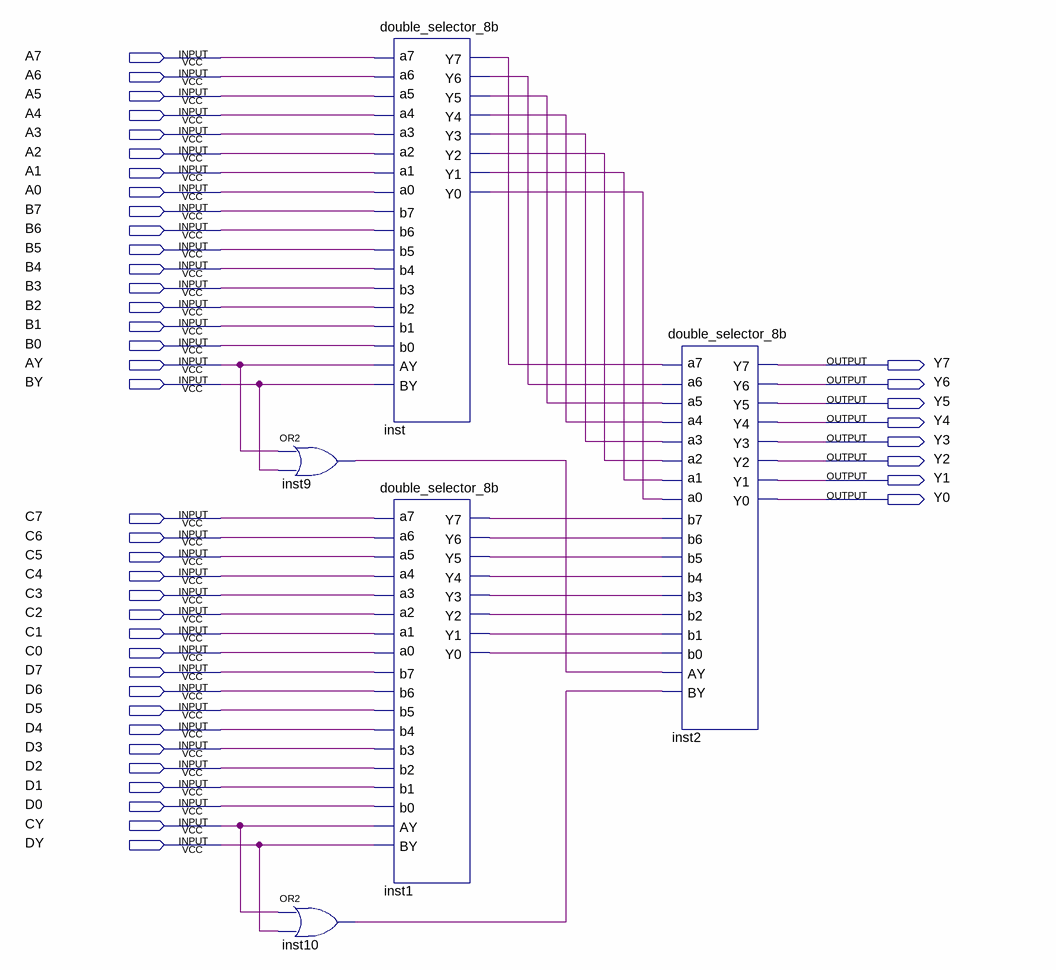
[diagram p0: schematic sheet]
// Quartus schematic quarter_selector_8b.bdf as structural Verilog: 5 symbols, 44 pins
module quarter_selector_8b (
  input  A7,
  input  A6,
  input  A5,
  input  A4,
  input  A3,
  input  A2,
  input  A1,
  input  A0,
  input  B7,
  input  B6,
  input  B5,
  input  B4,
  input  B3,
  input  B2,
  input  B1,
  input  B0,
  input  AY,
  input  BY,
  input  C7,
  input  C6,
  input  C5,
  input  C4,
  input  C3,
  input  C2,
  input  C1,
  input  C0,
  input  D7,
  input  D6,
  input  D5,
  input  D4,
  input  D3,
  input  D2,
  input  D1,
  input  D0,
  input  CY,
  input  DY,
  output Y7,
  output Y6,
  output Y5,
  output Y4,
  output Y3,
  output Y2,
  output Y1,
  output Y0
);

  wire inst1_y0, inst1_y1, inst1_y2, inst1_y3, inst1_y4, inst1_y5, inst1_y6, inst1_y7, inst9_out, inst10_out,
       inst_y0, inst_y1, inst_y2, inst_y3, inst_y4, inst_y5, inst_y6, inst_y7;

  or inst9 (inst9_out, AY, BY);
  or inst10 (inst10_out, CY, DY);
  double_selector_8b inst (
    .a0(A0), .a1(A1), .a2(A2), .a3(A3), .a4(A4), .a5(A5), .a6(A6), .a7(A7), .b0(B0), .b1(B1), .b2(B2),
    .b3(B3), .b4(B4), .b5(B5), .b6(B6), .b7(B7), .AY(AY), .BY(BY), .Y0(inst_y0), .Y1(inst_y1), .Y2(inst_y2),
    .Y3(inst_y3), .Y4(inst_y4), .Y5(inst_y5), .Y6(inst_y6), .Y7(inst_y7));
  double_selector_8b inst1 (
    .a0(C0), .a1(C1), .a2(C2), .a3(C3), .a4(C4), .a5(C5), .a6(C6), .a7(C7), .b0(D0), .b1(D1), .b2(D2),
    .b3(D3), .b4(D4), .b5(D5), .b6(D6), .b7(D7), .AY(CY), .BY(DY), .Y0(inst1_y0), .Y1(inst1_y1),
    .Y2(inst1_y2), .Y3(inst1_y3), .Y4(inst1_y4), .Y5(inst1_y5), .Y6(inst1_y6), .Y7(inst1_y7));
  double_selector_8b inst2 (
    .a0(inst_y0), .a1(inst_y1), .a2(inst_y2), .a3(inst_y3), .a4(inst_y4), .a5(inst_y5), .a6(inst_y6),
    .a7(inst_y7), .b0(inst1_y0), .b1(inst1_y1), .b2(inst1_y2), .b3(inst1_y3), .b4(inst1_y4), .b5(inst1_y5),
    .b6(inst1_y6), .b7(inst1_y7), .AY(inst9_out), .BY(inst10_out), .Y0(Y0), .Y1(Y1), .Y2(Y2), .Y3(Y3),
    .Y4(Y4), .Y5(Y5), .Y6(Y6), .Y7(Y7));
endmodule
